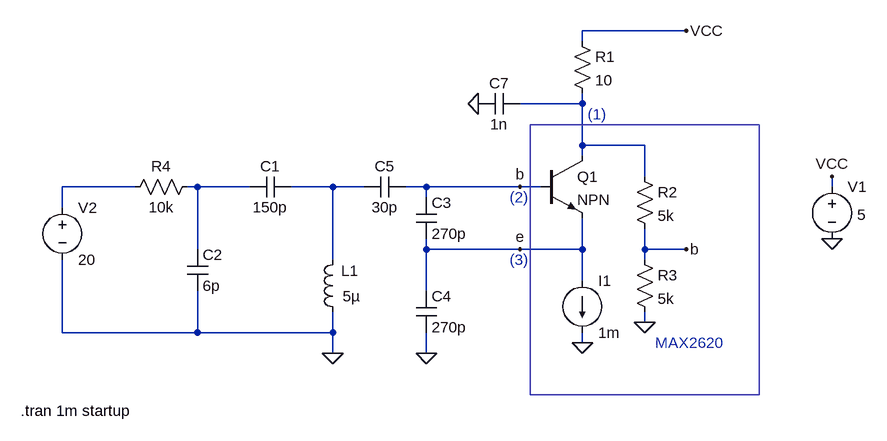
[diagram p0: schematic colpitts.asc]
colpitts.asc, the LTspice schematic file:
Version 4
SHEET 1 880 680
WIRE 496 -32 336 -32
WIRE 336 -16 336 -32
WIRE 336 80 336 64
WIRE 336 80 240 80
WIRE 336 144 336 80
WIRE 432 144 336 144
WIRE 336 160 336 144
WIRE 432 192 432 144
WIRE -352 208 -464 208
WIRE -256 208 -272 208
WIRE -176 208 -256 208
WIRE -48 208 -112 208
WIRE 0 208 -48 208
WIRE 96 208 64 208
WIRE 240 208 96 208
WIRE 272 208 240 208
WIRE 720 208 720 192
WIRE 96 224 96 208
WIRE -464 240 -464 208
WIRE -256 304 -256 208
WIRE 96 304 96 288
WIRE 240 304 96 304
WIRE 336 304 336 256
WIRE 336 304 240 304
WIRE 432 304 432 272
WIRE 496 304 432 304
WIRE -48 320 -48 208
WIRE 432 320 432 304
WIRE 336 352 336 304
WIRE 96 368 96 304
WIRE 432 416 432 400
WIRE -464 432 -464 320
WIRE -256 432 -256 368
WIRE -256 432 -464 432
WIRE -48 432 -48 400
WIRE -48 432 -256 432
WIRE 336 448 336 432
WIRE -48 464 -48 432
WIRE 96 464 96 432
FLAG -48 464 0
FLAG 96 464 0
FLAG 176 80 0
FLAG 432 416 0
FLAG 496 304 b
FLAG 240 208 b
FLAG 240 304 e
FLAG 496 -32 VCC
FLAG 720 288 0
FLAG 720 192 VCC
FLAG 336 448 0
SYMBOL ind -32 416 R180
WINDOW 0 3 79 Right 0
WINDOW 3 1 40 Right 0
SYMATTR InstName L1
SYMATTR Value 5µ
SYMATTR SpiceLine Rser=0.1
SYMBOL cap 80 224 R0
SYMATTR InstName C3
SYMATTR Value 270p
SYMBOL cap 80 368 R0
SYMATTR InstName C4
SYMATTR Value 270p
SYMBOL res 320 -32 R0
SYMATTR InstName R1
SYMATTR Value 10
SYMBOL cap 240 64 R90
WINDOW 0 0 32 VBottom 0
WINDOW 3 32 32 VTop 0
SYMATTR InstName C7
SYMATTR Value 1n
SYMBOL res 416 176 R0
SYMATTR InstName R2
SYMATTR Value 5k
SYMBOL res 416 304 R0
SYMATTR InstName R3
SYMATTR Value 5k
SYMBOL voltage 720 192 R0
WINDOW 3 39 59 Left 0
WINDOW 123 0 0 Left 0
WINDOW 39 0 0 Left 0
SYMATTR Value 5
SYMATTR InstName V1
SYMBOL npn 272 160 R0
SYMATTR InstName Q1
SYMBOL cap 64 192 R90
WINDOW 0 0 32 VBottom 0
WINDOW 3 32 32 VTop 0
SYMATTR InstName C5
SYMATTR Value 30p
SYMBOL current 336 352 R0
WINDOW 123 0 0 Left 0
WINDOW 39 0 0 Left 0
SYMATTR InstName I1
SYMATTR Value 1m
SYMBOL res -256 192 R90
WINDOW 0 0 56 VBottom 0
WINDOW 3 32 56 VTop 0
SYMATTR InstName R4
SYMATTR Value 10k
SYMBOL cap -112 192 R90
WINDOW 0 0 32 VBottom 0
WINDOW 3 32 32 VTop 0
SYMATTR InstName C1
SYMATTR Value 150p
SYMBOL voltage -464 224 R0
WINDOW 123 0 0 Left 0
WINDOW 39 0 0 Left 0
SYMATTR InstName V2
SYMATTR Value 20
SYMBOL cap -272 304 R0
SYMATTR InstName C2
SYMATTR Value 6p
TEXT -528 552 Left 0 !.tran 1m startup
TEXT 448 448 Left 0 ;MAX2620
TEXT 344 96 Left 0 ;(1)
TEXT 224 224 Left 0 ;(2)
TEXT 224 320 Left 0 ;(3)
RECTANGLE Normal 608 528 256 112

The netlist it stands for:
* colpitts.asc
L1 0 N004 5µ Rser=0.1
C3 b e 270p
C4 e 0 270p
R1 VCC N001 10
C7 N001 0 1n
R2 N001 b 5k
R3 b 0 5k
V1 VCC 0 5
Q1 N001 b e 0 NPN
C5 b N004 30p
I1 e 0 1m
R4 N003 N002 10k
C1 N004 N003 150p
V2 N002 0 20
C2 N003 0 6p
.model NPN NPN
.model PNP PNP
.lib standard.bjt
.tran 1m startup
* MAX2620
* (1)
* (2)
* (3)
.backanno
.end